# EasyEDA Pro project v1_for_cam.eprj

# Schematic Schematic1
Board Name: Board1; Create Date: 2025-01-07; Page Name: P1; Project Name: v1_for_cam; Schematic Name: Schematic1; Update Date: 2025-01-17; Company: EasyEDA.com; Page Size: A4; Version: V1.0
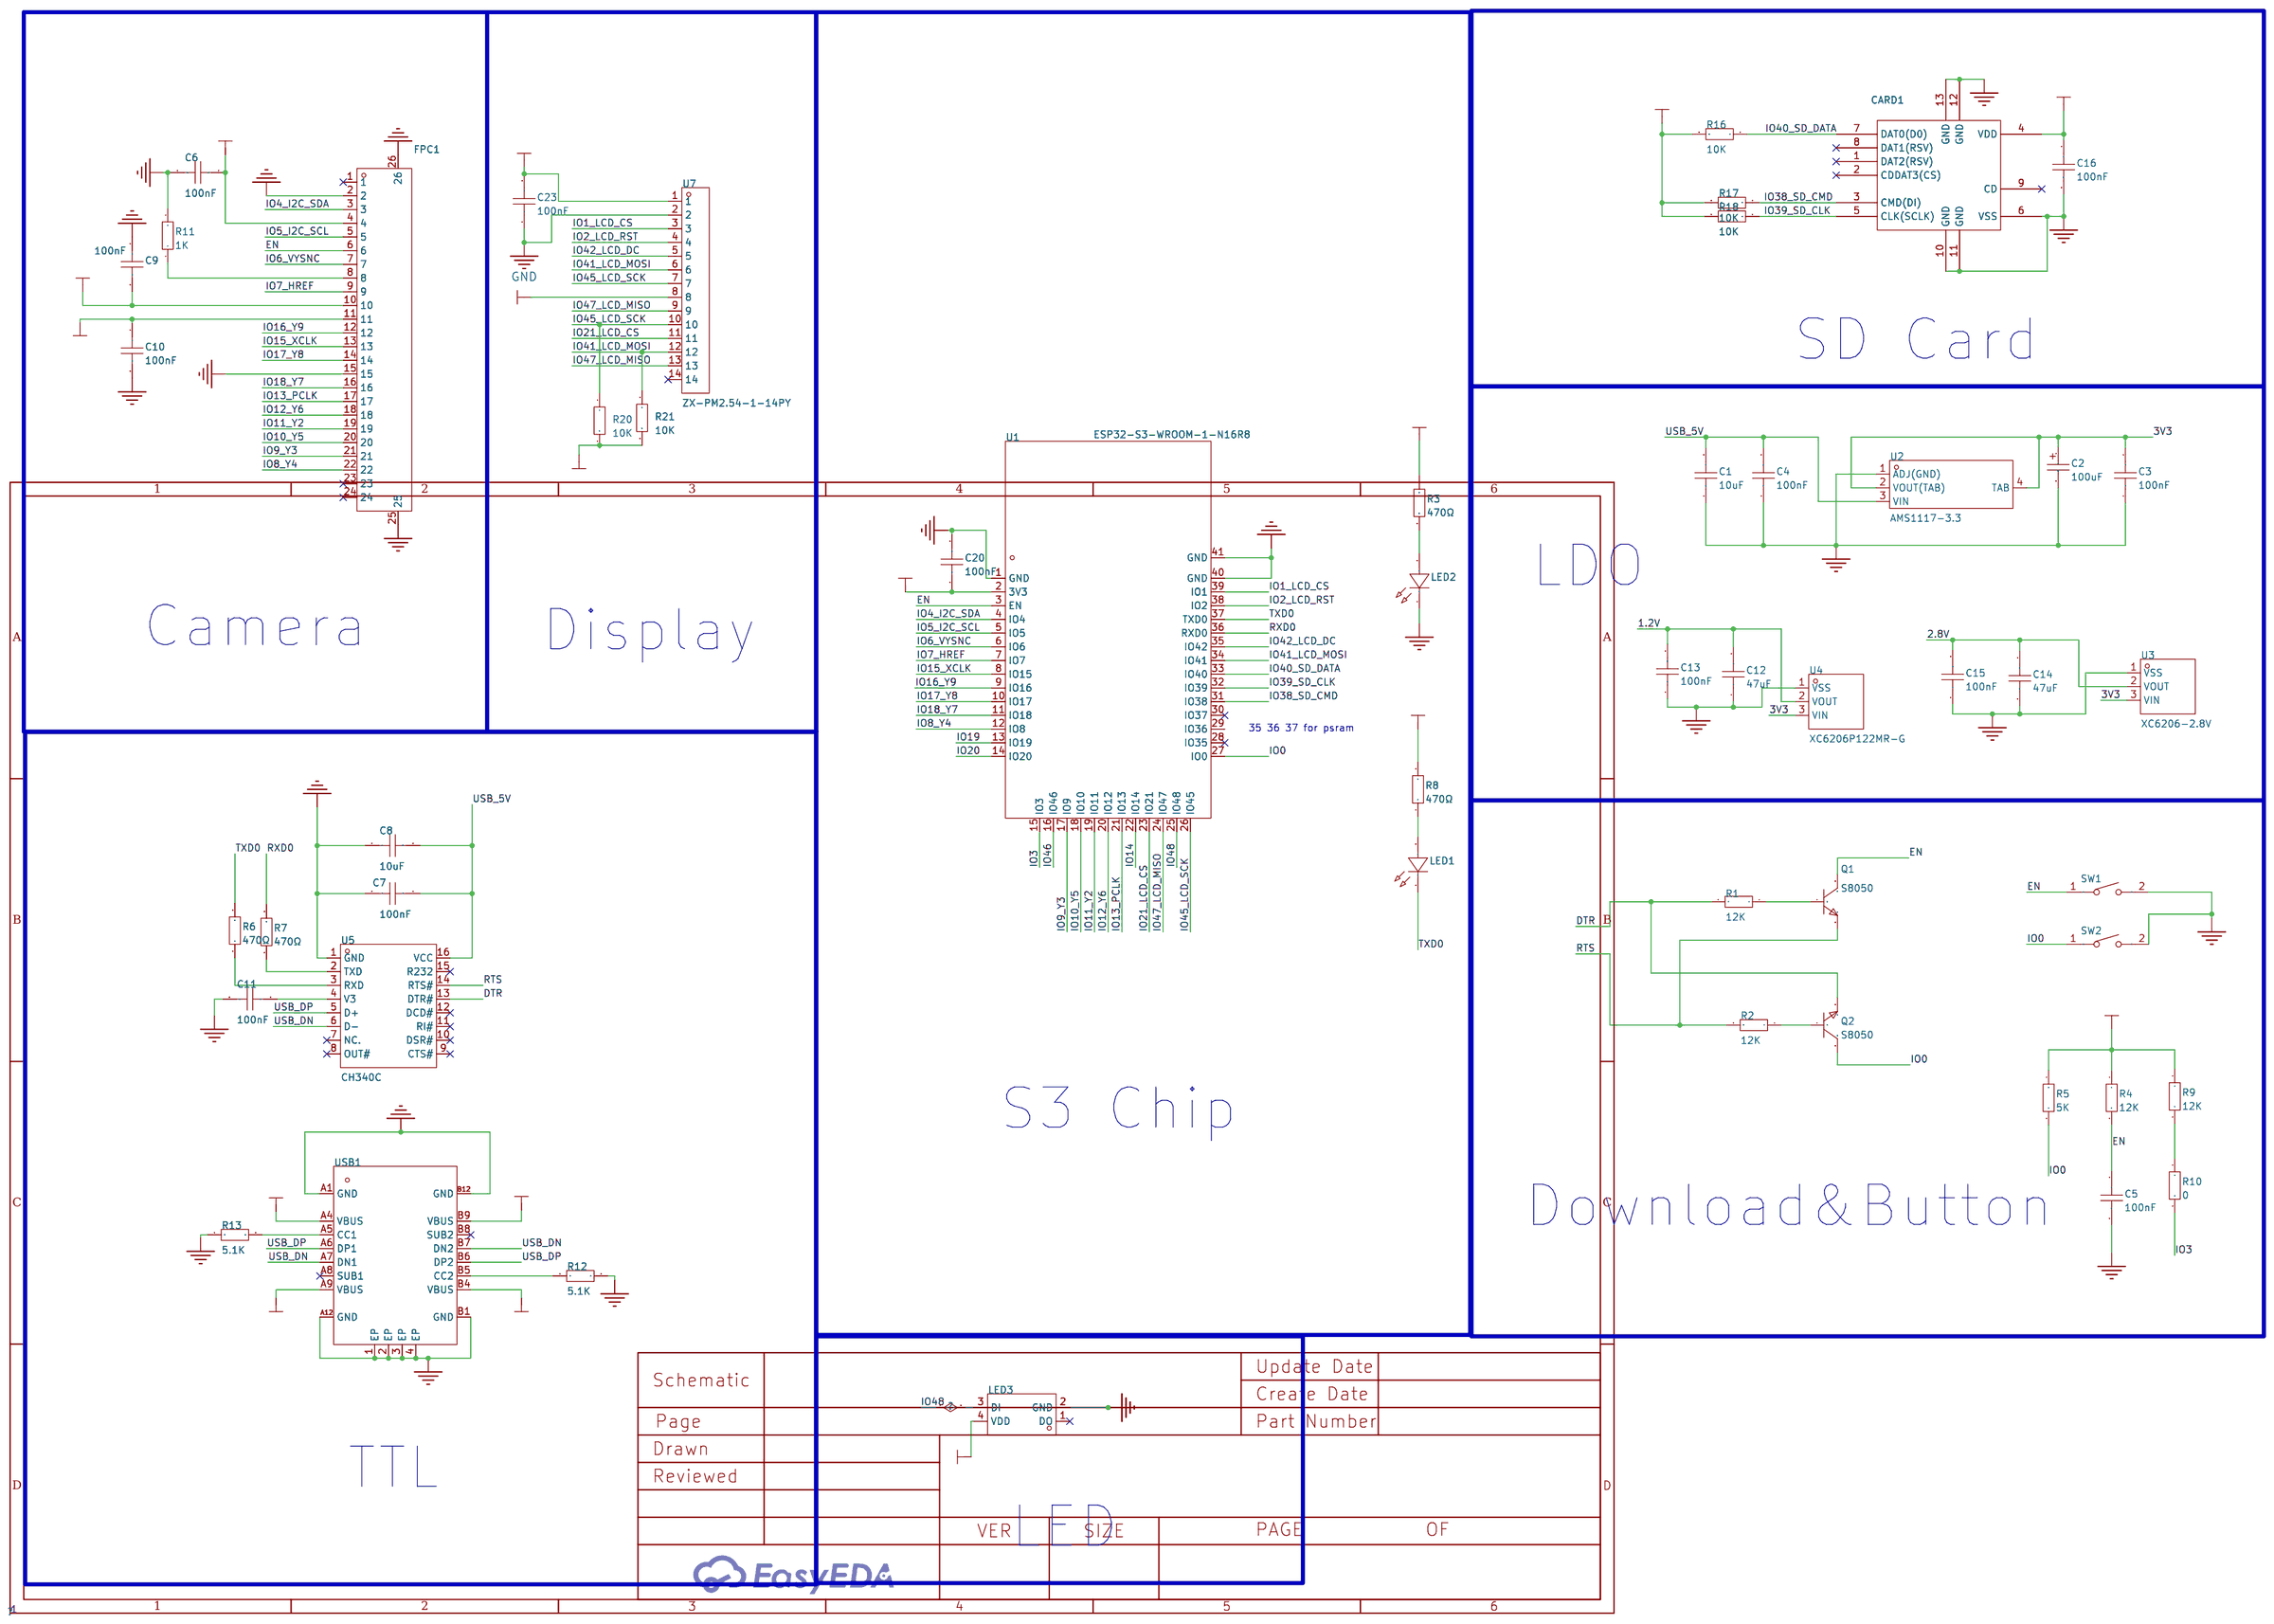
[diagram p0: schematic sheet]

## Parts
C1  10uF  [C0603]
C2  100uF  [CASE-B_3528]
C3  100nF  [C0402]
C4  100nF  [C0402]
C5  100nF  [C0402]
C6  100nF  [C0402]
C7  100nF  [C0402]
C8  10uF  [C0603]
C9  100nF  [C0402]
C10  100nF  [C0402]
C11  100nF  [C0402]
C12  47uF  [C0603]
C13  100nF  [C0402]
C14  47uF  [C0603]
C15  100nF  [C0402]
C16  100nF  [C0402]
C20  100nF  [C0402]
C23  100nF  [C0402]
CARD1  TF-01A  [TF-SMD_TF-01A]
FPC1  0.5K-DX-24PWBG  [FPC-SMD_HDGC_0.5K-DX-24PWBG]
LED1  XL-1608SURC-06  [LED0603-RD_RED]
LED2  XL-1608SURC-06  [LED0603-RD_RED]
LED3  XL-2020RGBC-WS2812B  [LED-SMD_4P-L2.0-W2.0-BR-1]
Q1  S8050  [SOT-23-3_L2.9-W1.3-P1.90-LS2.3-BR]
Q2  S8050  [SOT-23-3_L2.9-W1.3-P1.90-LS2.3-BR]
R1  12K  [R0402]
R2  12K  [R0402]
R3  470Ω  [R0402]
R4  12K  [R0402]
R5  5K  [R0402]
R6  470Ω  [R0402]
R7  470Ω  [R0402]
R8  470Ω  [R0402]
R9  12K  [R0402]
R10  0  [R0402]
R11  1K  [R0402]
R12  5.1K  [R0402]
R13  5.1K  [R0402]
R16  10K  [R0402]
R17  10K  [R0402]
R18  10K  [R0402]
R20  10K  [R0402]
R21  10K  [R0402]
SW1  TS-1088-AR02016  [SW-SMD_L3.9-W3.0-P4.45]
SW2  TS-1088-AR02016  [SW-SMD_L3.9-W3.0-P4.45]
U1  ESP32-S3-WROOM-1-N16R8  [WIRELM-SMD_ESP32-S3-WROOM-1]
U2  AMS1117-3.3  [SOT-223-4_L6.5-W3.5-P2.30-LS7.0-BR]
U3  XC6206-2.8V  [SOT-23-3_L2.9-W1.6-P1.90-LS2.8-BR]
U4  XC6206P122MR-G  [SOT-23-3_L2.9-W1.6-P1.90-LS2.8-BR]
U5  CH340C  [SOP-16_L10.0-W3.9-P1.27-LS6.0-BL]
U7  ZX-PM2.54-1-14PY  [HDR-TH_14P-P2.54-V-F]
USB1  KH-TYPE-C-16P  [USB-C-SMD_KH-TYPE-C-16P]

## Library data of the parts
C1 C8 = CGA0603X5R106K100JT: 容值:10uF;精度:±10%;额定电压:10V;材质(温度系数):X5R;; LCSC Part Name: 10uF ±10% 10V; Supplier Part: C6119842; Manufacturer: HRE(芯声); Supplier Footprint: 0603; JLCPCB Part Class: 扩展库; Supplier: LCSC; Tolerance: ±10%; Voltage Rated: 10V; Temperature Coefficient: X5R
C2 = TAJB107K006RNJ: LCSC Part Name: 100uF ±10% 6.3V; Supplier Part: C16133; Manufacturer: Kyocera AVX; Supplier Footprint: CASE-B-3528-21(mm); Datasheet: https://atta.szlcsc.com/upload/public/pdf/source/20160107/1457707750344.pdf; Supplier: LCSC; Tolerance: ±10%; Rated Voltage: 6.3V; Equivalent Series Resistance(ESR): 1.7Ω@100kHz; Operating Temperature: -55℃~+125℃
C3-C7 C9-C11 C13 C15 C16 C20 C23 = CL05B104KO5NNNC: 容值:100nF;精度:±10%;额定电压:16V;材质(温度系数):X7R;; LCSC Part Name: 100nF ±10% 16V; Supplier Part: C1525; Manufacturer: SAMSUNG(三星); Supplier Footprint: 0402; Datasheet: https://atta.szlcsc.com/upload/public/pdf/source/20160218/1457707763339.pdf; Supplier: LCSC; Tolerance: ±10%; Voltage Rated: 16V; Temperature Coefficient: X7R
C12 C14 = CL10A476MQ8QRNC: 容值:47uF;精度:±20%;额定电压:6.3V;材质(温度系数):X5R;; LCSC Part Name: 47uF ±20% 6.3V; Supplier Part: C730416; Manufacturer: SAMSUNG(三星); Supplier Footprint: 0603; JLCPCB Part Class: 扩展库; Datasheet: https://atta.szlcsc.com/upload/public/pdf/source/20160218/1457707763339.pdf; Supplier: LCSC; Tolerance: ±20%; Voltage Rated: 6.3V; Temperature Coefficient: X5R
CARD1 = TF-01A_C91145: 卡连接方式:自弹式;卡类型:MicroSD卡(TF卡);连接器类型:卡座;本体最大高度:1.85mm;工作温度范围:-;; LCSC Part Name: 自弹式 MicroSD卡(TF卡) 卡座; Supplier Part: C91145; Manufacturer: 韩国韩荣; Supplier Footprint: SMD; JLCPCB Part Class: 扩展库; Datasheet: https://atta.szlcsc.com/upload/public/pdf/source/20190322/C91145_63CBD6FB4639A3A3EC6A9721F18AE0FB.pdf; Supplier: LCSC; Card Connection Mode: 自弹式; Card Type: MicroSD卡(TF卡); Connector Type: 卡座; Supplementary Features: 带定位柱; Maximum Body Height: 1.85mm
FPC1 = 0.5K-DX-24PWBG: 锁定特性:翻盖式;触点类型:下接;触点数量:24P;间距:0.5mm;安装类型:卧贴;工作温度范围:-20℃~+85℃;; LCSC Part Name: 间距:0.5mm P数:24P 翻盖式 下接; Supplier Part: C2911895; Manufacturer: HDGC(华德共创); Supplier Footprint: SMD,P=0.5mm,卧贴; JLCPCB Part Class: 扩展库; Datasheet: https://atta.szlcsc.com/upload/public/pdf/source/20211029/EDC59C5BA257836333CAE013AFC084A6.pdf; Supplier: LCSC; Locking Feature: 翻盖式; Contact Type: 下接; Number of Contacts: 24P; Pitch: 0.5mm; Mounting Type: 卧贴; FFC, FCB Thickness: 0.3mm; Height Above Board: 2mm; Operating Temperature Range: -20℃~+85℃
LED1 LED2 = XL-1608SURC-06: 发光颜色:红色;功率:55mW;正向电流:25mA;主波长:617nm~621nm;透镜颜色:无色透明透镜;色温:-;发光角度:120°;载带方式:正贴;工作温度:-30℃~+85℃;; Supplier Part: C965799; Manufacturer: XINGLIGHT(成兴光); Supplier Footprint: 0603; JLCPCB Part Class: 扩展库; Datasheet: https://atta.szlcsc.com/upload/public/pdf/source/20221102/D860AFDD1CDB02C5A8064103A32707E2.pdf; Supplier: LCSC; Emitted Color: 红色; Power Dissipation: 55mW; Forward Current: 25mA; Dominant Wavelength: 617nm~621nm; Peak Wavelength: 623nm; Lens Color: 无色透明透镜; Viewing Angle: 120°; Mounting Sytle: 正贴; Operating Temperature: -30℃~+85℃
LED3 = XL-2020RGBC-WS2812B: 2020 ws2812B 内置驱动IC（红：IV=50-150mcd，绿：IV=200-400mcd，蓝：IV=50-150mcd，(Typ)@IF=20mA); LCSC Part Name: 幻彩透明; Supplier Part: C5349955; Manufacturer: XINGLIGHT(成兴光); Supplier Footprint: 2020; JLCPCB Part Class: 扩展库; Datasheet: https://atta.szlcsc.com/upload/public/pdf/source/20230111/97A2D5930F183799801175706AF118AF.pdf; Supplier: LCSC; Wavelength: 620nm~625nm；470nm~475nm；525nm~530nm; Luminous Intensity: 150mcd；150mcd；400mcd; Lens Color: 半透明雾状透镜; Installation method: 正贴; Operating Temperature: -20℃~+85℃
Q1 Q2 = S8050_C20069125: 晶体管类型:NPN;集电极电流(Ic):500mA;集射极击穿电压(Vceo):25V;功率(Pd):300mW;直流电流增益(hFE@Ic,Vce):120@50mA,1.0V;; LCSC Part Name: hFE:200-350，丝印:J3Y; Supplier Part: C20069125; Manufacturer: 宏迦橙; Supplier Footprint: SOT-23; JLCPCB Part Class: 扩展库; Datasheet: https://atta.szlcsc.com/upload/public/pdf/source/20240403/2D78449C96B6E27F13BF8BDF79E27159.pdf; Supplier: LCSC; Transistor Type: NPN; Collector Current (Ic): 500mA; Collector-Emitter Breakdown Voltage (Vceo): 25V; Power Dissipation (Pd): 300mW; DC Current Gain (hFE@Ic,Vce): 120@50mA,1.0V; Transition Frequency (fT): 100MHz; Collector Cut-Off Current (Icbo): 100nA; Collector-Emitter Saturation Voltage (VCE(sat)@Ic,Ib): 600mV@500mA,50mA; Operating Temperature: -55℃~+150℃
R1-R13 R16-R18 R20 R21 = 0402WGF4700TCE: 电阻类型:厚膜电阻;阻值:470Ω;精度:±1%;功率:62.5mW;最大工作电压:50V;温度系数:±100ppm/℃;; LCSC Part Name: 470Ω ±1% 62.5mW 厚膜电阻; Supplier Part: C25117; Manufacturer: UNI-ROYAL(厚声); Supplier Footprint: 0402; JLCPCB Part Class: 基础库; Datasheet: https://atta.szlcsc.com/upload/public/pdf/source/20200306/C422600_1E6D84923E4A46A82E41ADD87F860B5C.pdf; Supplier: LCSC; Type: 厚膜电阻; Tolerance: ±1%; Power(Watts): 62.5mW; Overload Voltage (Max): 50V; Temperature Coefficient: ±100ppm/℃; Operating Temperature Range: -55℃~+155℃
SW1 SW2 = TS-1088-AR02016: 电路结构:单刀单掷;按钮形状:圆形按钮;作用力:160gf;安装方式:立贴;开关长度:4mm;开关宽度:3mm;开关高度:2mm;带支架:不带;触点电流:50mA;额定电压(DC):12V;绝缘电阻:100MΩ;机械寿命:10万次;; LCSC Part Name: 4*3*2mm 立贴 轻触开关; Supplier Part: C720477; Manufacturer: XUNPU(讯普); Supplier Footprint: SMD; JLCPCB Part Class: 扩展库; Datasheet: https://atta.szlcsc.com/upload/public/pdf/source/20200810/C720475_60D09DD6C54279ADDB2DC25100F1CC11.pdf; Supplier: LCSC; Circuit: 单刀单掷; Actuator Style: 圆形按钮; Operating Force: 160gf; Mounting Style: 立贴; Switch Length: 4mm; Switch Width: 3mm; Switch Height: 2mm; Strike Gundam: 不带; Contact Current: 50mA; Voltage Rating (DC): 12V; Insulation Resistance: 100MΩ; Actuator/Cap Color: 黑色; Pin Style: SMD接片; Mechanical Life: 10万次; Operating Temperature: -30℃~+80℃
U1 = ESP32-S3-WROOM-1-N16R8: LCSC Part Name: 通用型Wi-Fi+低功耗蓝牙MCU模组; Supplier Part: C2913202; Manufacturer: ESPRESSIF(乐鑫); Supplier Footprint: SMD,18x25.5mm; JLCPCB Part Class: 扩展库; Datasheet: https://atta.szlcsc.com/upload/public/pdf/source/20220705/4E799F39581577F766659887F738A439.pdf; Supplier: LCSC
U2 = AMS1117-3.3_C347222: 输出类型:固定;工作电压:12V;输出电压:3.3V;输出电流:1A;电源纹波抑制比(PSRR):60dB@(120Hz);输出极性:正极;; LCSC Part Name: 输出:3.3V 电流:1A 耐压:12V; Supplier Part: C347222; Manufacturer: UMW(友台半导体); Supplier Footprint: SOT-223; JLCPCB Part Class: 扩展库; Datasheet: https://atta.szlcsc.com/upload/public/pdf/source/20241218/BAF0263FA2E44BCD8AF41AA4FA04EFAA.pdf; Supplier: LCSC; Output Type: 固定; Maximum Input Voltage: 12V; Output Voltage: 3.3V; Output Current: 1A; Power Supply Rejection Ratio (PSRR): 60dB@(120Hz); Dropout Voltage: 1.3V@(1A); Feature: 过流保护(OCP); Output Polarity: 正极; Number of Outputs: 1
U3 = XC6206-2.8V: 输出类型:固定;最大输入电压:6V;输出电压:2.8V;最大输出电流:250mA;输出极性:正极;; LCSC Part Name: 输入6V 输出2.8V 250mA; Supplier Part: C2892669; Manufacturer: YONGYUTAI(永裕泰); Supplier Footprint: SOT-23-3L; JLCPCB Part Class: 扩展库; Datasheet: https://atta.szlcsc.com/upload/public/pdf/source/20210901/DE3C77F0CE73FFE8F7C655BE9B94CB06.pdf; Supplier: LCSC; Output Type: 固定; Maximum Input Voltage: 6V; Output Voltage: 2.8V; MAX Output Current: 250mA; Operating Temperature: -40℃~+85℃@(Tj); Output Polarity: 正极; Number of Outputs: 1
U4 = XC6206P122MR-G: 输出类型:固定;最大输入电压:7V;输出电压:1.2V;最大输出电流:60mA;电源纹波抑制比(PSRR):-;输出极性:正极;; LCSC Part Name: 输入7V 输出1.2V~1.2V 60mA; Supplier Part: C424699; Manufacturer: TOREX(特瑞仕); Supplier Footprint: SOT-23; JLCPCB Part Class: 扩展库; Datasheet: https://atta.szlcsc.com/upload/public/pdf/source/20200117/C484266_EE638359EA530088949E891FD0EEEA32.pdf; Supplier: LCSC; Output Type: 固定; Maximum Input Voltage: 7V; Output Voltage: 1.2V; MAX Output Current: 60mA; Dropout Voltage: 960mV@(60mA); standby current: 3uA; Operating Temperature: -40℃~+85℃@(Ta); Output Polarity: 正极; Number of Outputs: 1
U5 = CH340C: 应用功能:收发器;接口协议:USB 2.0;数据速率:2Mbps;; LCSC Part Name: CH340C USB转串口芯片 CH340; Supplier Part: C84681; Manufacturer: WCH(南京沁恒); Supplier Footprint: SOP-16; Datasheet: https://atta.szlcsc.com/upload/public/pdf/source/20240619/63986D8440D4E5267A77ACD891CC4DE3.pdf; Supplier: LCSC; Applications Function: 收发器; Protocol: USB 2.0; Supply Voltage: 3.3V；5V; Data Rate: 2Mbps
U7 = ZX-PM2.54-1-14PY: LCSC Part Name: 1x14P 间距:2.54mm 直插; Supplier Part: C7499332; Manufacturer: Megastar(兆星); Supplier Footprint: 插件,P=2.54mm; Datasheet: https://atta.szlcsc.com/upload/public/pdf/source/20231122/596EEFA73C1FA9E4FFE7F8A6F76E9BC7.pdf; Supplier: LCSC; Holes Structure: 1x14P; Pitch: 2.54mm; Circular Hole / Square Hole: Square Hole; Mounting Type: Direct Insert; Number of Rows: Single Row; Number of Holes: 14P; Voltage Rating (Max): 1kV; Holes Direction: Top; Insulation Height: 8.5mm; Contact Plating: Gold; Operating Temperature Range: -40℃~+105℃; Soldering Temperature(Max): 260℃@5S
USB1 = KH-TYPE-C-16P: 连接器类型:Type-C;标准:-;公母:母;端口数量:1;触点数量:16P;安装方式:卧贴;额定电流 - 电源:3A;工作温度范围:-40℃~+85℃;; LCSC Part Name: Type-C 母 卧贴; Supplier Part: C709357; Manufacturer: kinghelm(金航标); Supplier Footprint: SMD; Datasheet: https://atta.szlcsc.com/upload/public/pdf/source/20200911/C709357_AA8DCEB38BB20E3035A7ED7AE7667837.pdf; Supplier: LCSC; Connector Type: Type-C; Gender: 母; Number of Ports: 1; Number of Contacts: 16P; Mounting Style: 卧贴; Current Rating - Power (Max): 3A; Operating Temperature Range: -40℃~+85℃

## Nets
1.2V: C9.2 C12.2 C13.2 FPC1.10 U4.2(VOUT)
2.8V: C6.1 C10.1 C14.1 C15.2 FPC1.4 FPC1.11 U3.2(VOUT)
3V3: C2.1 C3.2 C16.1 C20.1 C23.2 CARD1.4(VDD) R3.1 R4.1 R5.1 R8.2 R9.1 R16.2 R17.2 R18.2 R20.2 R21.2 U1.2(3V3) U2.2(VOUT(TAB)) U2.4(TAB) U3.3(VIN) U4.3(VIN) U7.1 U7.8
GND: C1.1 C2.2 C3.1 C4.1 C5.2 C6.2 C7.2 C8.2 C9.1 C10.2 C11.2 C12.1 C13.1 C14.2 C15.1 C16.2 C20.2 C23.1 CARD1.6(VSS) CARD1.10(GND) CARD1.11(GND) CARD1.12(GND) CARD1.13(GND) FPC1.2 FPC1.15 FPC1.25 FPC1.26 LED2.1(K) LED3.2(GND) R11.2 R12.2 R13.1 SW1.2 SW2.2 U1.1(GND) U1.40(GND) U1.41(GND) U2.1(ADJ(GND)) U3.1(VSS) U4.1(VSS) U5.1(GND) U7.2 USB1.1(EP) USB1.2(EP) USB1.3(EP) USB1.4(EP) USB1.A1(GND) USB1.A12(GND) USB1.B1(GND) USB1.B12(GND)
DTR: Q2.2(E) R1.2 U5.13(DTR#)
EN: C5.1 FPC1.6 Q1.3(C) R4.2 SW1.1 U1.3(EN)
IO0: Q2.3(C) R5.2 SW2.1 U1.27(IO0)
IO1_LCD_CS: U1.39(IO1) U7.3
IO2_LCD_RST: U1.38(IO2) U7.4
IO3: R10.2 U1.15(IO3)
IO4_I2C_SDA: FPC1.3 U1.4(IO4)
IO5_I2C_SCL: FPC1.5 U1.5(IO5)
IO6_VYSNC: FPC1.7 U1.6(IO6)
IO7_HREF: FPC1.9 U1.7(IO7)
IO8_Y4: FPC1.22 U1.12(IO8)
IO9_Y3: FPC1.21 U1.17(IO9)
IO10_Y5: FPC1.20 U1.18(IO10)
IO11_Y2: FPC1.19 U1.19(IO11)
IO12_Y6: FPC1.18 U1.20(IO12)
IO13_PCLK: FPC1.17 U1.21(IO13)
IO14: U1.22(IO14)
IO15_XCLK: FPC1.13 U1.8(IO15)
IO16_Y9: FPC1.12 U1.9(IO16)
IO17_Y8: FPC1.14 U1.10(IO17)
IO18_Y7: FPC1.16 U1.11(IO18)
IO19: U1.13(IO19)
IO20: U1.14(IO20)
IO21_LCD_CS: U1.23(IO21) U7.11
IO38_SD_CMD: CARD1.3(CMD(DI)) R17.1 U1.31(IO38)
IO39_SD_CLK: CARD1.5(CLK(SCLK)) R18.1 U1.32(IO39)
IO40_SD_DATA: CARD1.7(DAT0(D0)) R16.1 U1.33(IO40)
IO41_LCD_MOSI: R21.1 U1.34(IO41) U7.6 U7.12
IO42_LCD_DC: U1.35(IO42) U7.5
IO45_LCD_SCK: R20.1 U1.26(IO45) U7.7 U7.10
IO46: U1.16(IO46)
IO47_LCD_MISO: U1.24(IO47) U7.9 U7.13
IO48: LED3.3(DI) U1.25(IO48)
RTS: Q1.2(E) R2.2 U5.14(RTS#)
RXD0: R7.2 U1.36(RXD0)
TXD0: LED1.1(K) R6.2 U1.37(TXD0)
USB_5V: C1.2 C4.2 C7.1 C8.1 LED3.4(VDD) U2.3(VIN) U5.16(VCC) USB1.A4(VBUS) USB1.A9(VBUS) USB1.B4(VBUS) USB1.B9(VBUS)
USB_DN: U5.6(D-) USB1.A7(DN1) USB1.B7(DN2)
USB_DP: U5.5(D+) USB1.A6(DP1) USB1.B6(DP2)
$1N3939: R7.1 U5.2(TXD)
$1N3940: R6.1 U5.3(RXD)
$1N3941: C11.1 U5.4(V3)
$1N3953: Q1.1(B) R1.1
$1N3956: Q2.1(B) R2.1
$1N3967: R9.2 R10.1
$1N4024: FPC1.8 R11.1
Net-(LED1-2): LED1.2(A) R8.1
Net-(LED2-2): LED2.2(A) R3.2
Net-(R12-1): R12.1 USB1.B5(CC2)
Net-(R13-2): R13.2 USB1.A5(CC1)

Not connected (* = marked no-connect by the designer): CARD1 1(DAT2(RSV))* 2(CDDAT3(CS))* 8(DAT1(RSV))* 9(CD)*; FPC1 1* 23* 24*; LED3 1(DO)*; U1 28(IO35)* 29(IO36) 30(IO37)*; U5 7(NC.)* 8(OUT#)* 9(CTS#)* 10(DSR#)* 11(RI#)* 12(DCD#)* 15(R232)*; U7 14*; USB1 A8(SUB1)* B8(SUB2)*

## Notes on the sheet
- SD Card
- LDO
- Camera
- Display
- 35 36 37 for psram
- S3 Chip
- Download&Button
- TTL
- LED

# Board PCB1
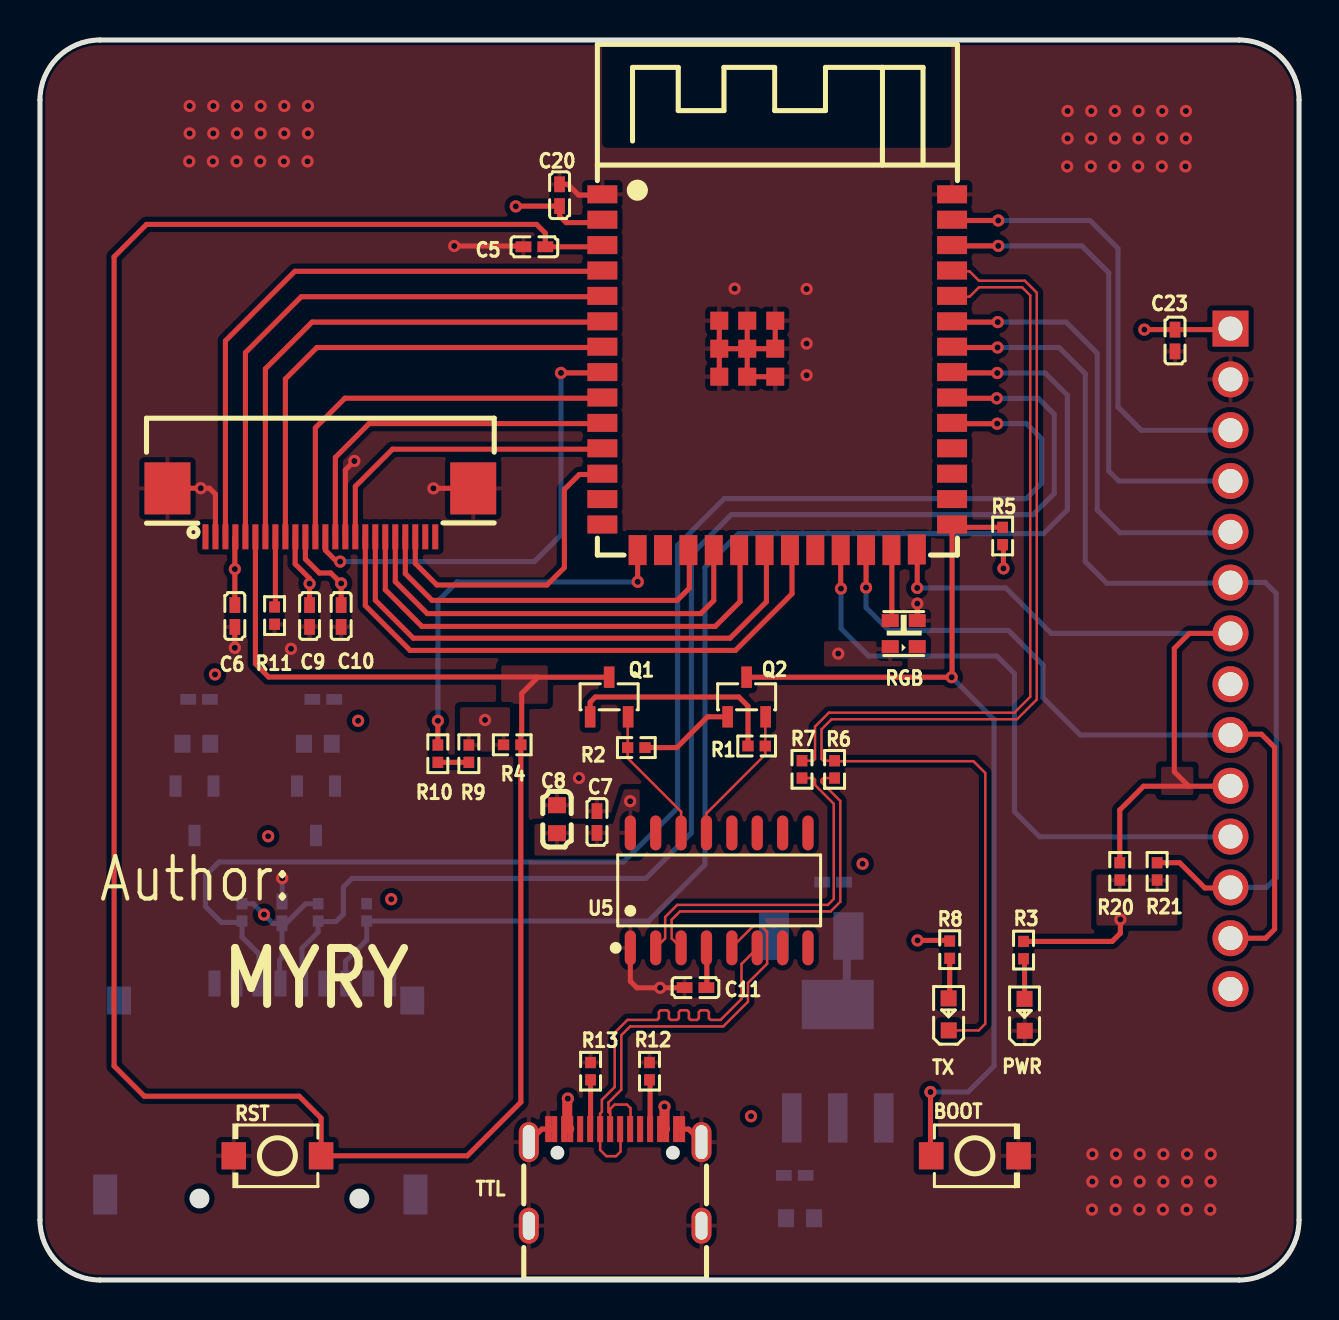
[diagram p1: board, top side]
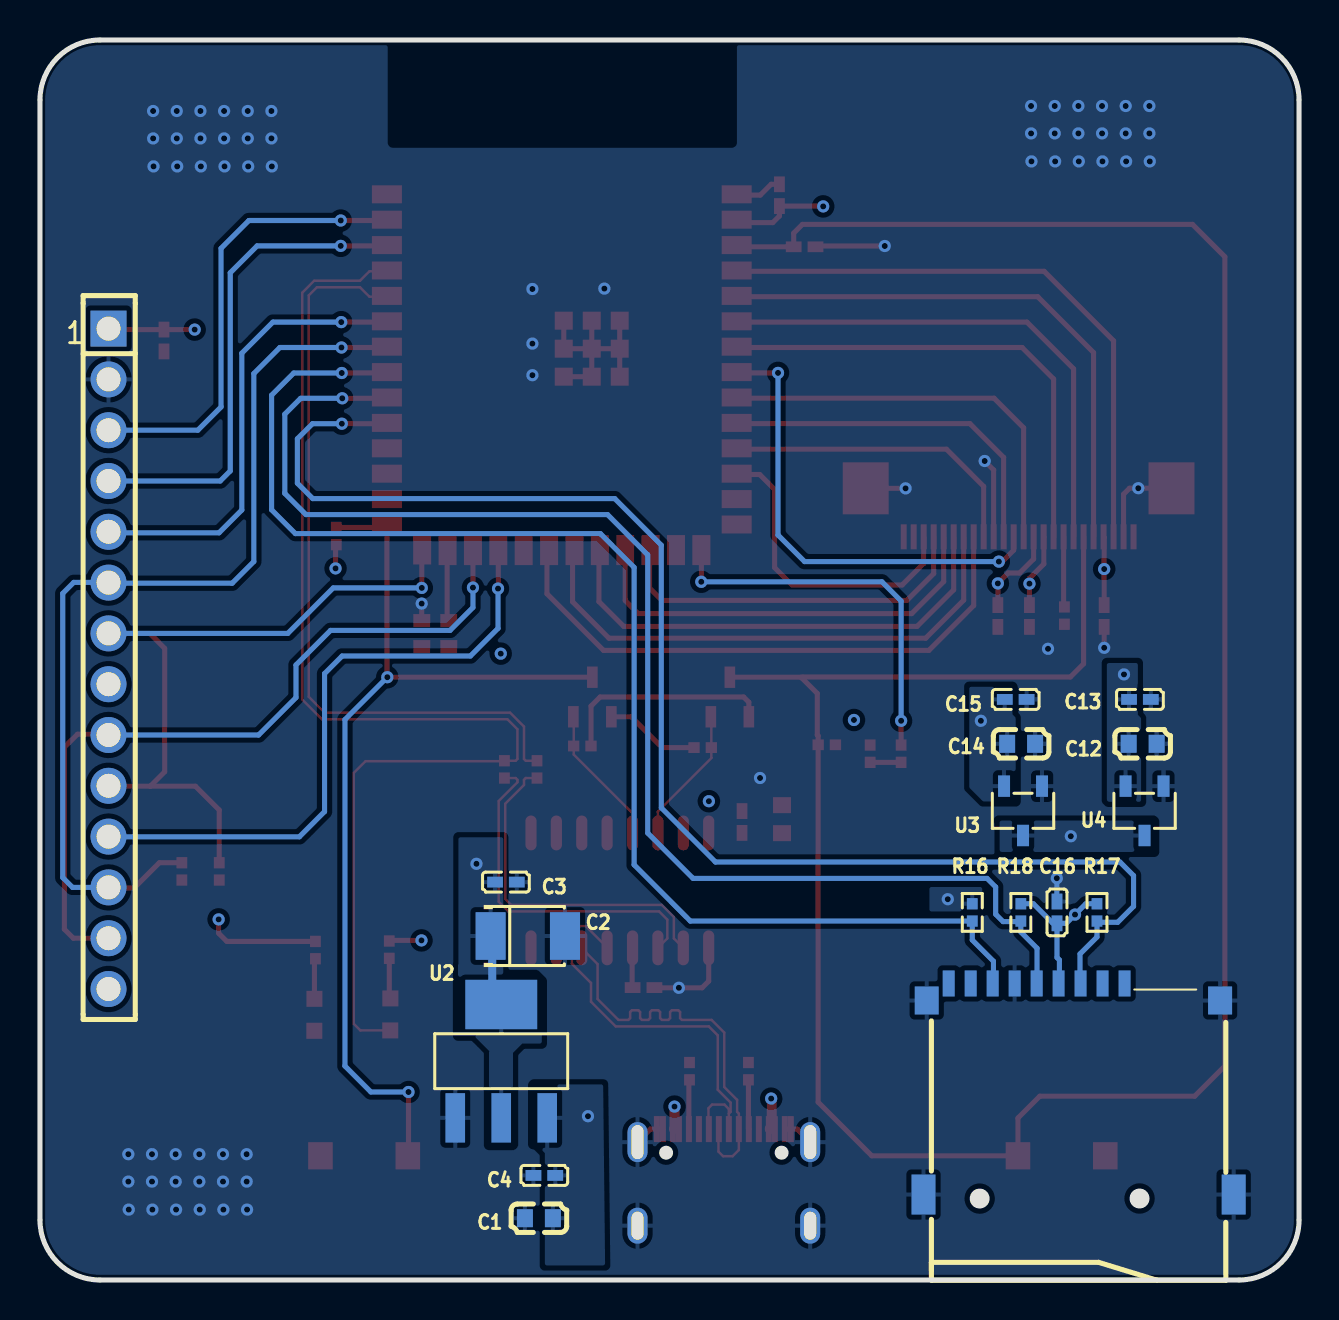
[diagram p2: board, bottom side, seen from below]

Outline 63 x 62 mm; copper layers: Top Layer, GND, PWR, Bottom Layer. Coordinates in mm from the lower left corner of the outline.
Outline path: 0,59 0,3 arc(0.88,0.88) 3,0 60,0 arc(62.12,0.88) 63,3 63,59 arc(62.12,61.12) 60,62 3,62 arc(0.88,61.12) 0,59
Stack: Top Layer 0.035mm Outer layer copper thickness 1oz / Dielectric1 0.0994mm 7628 RC49% 8.6mil / GND 0.0152mm Inner layer copper thickness / Dielectric2 1.265mm 1.1mm H/HOZ Copper / PWR 0.0152mm Inner layer copper thickness / Dielectric3 0.0994mm 7628 RC49% 8.6mil / Bottom Layer 0.035mm Outer layer copper thickness 1oz

## Design rules (mm)
net TXD0: DP3
net RTS: DP4
net DTR: DP4
net $1N3940: DP2
net RXD0: DP3
net $1N3939: DP2
net USB_DP: DP1
net USB_DN: DP1
template: Custom Config
spacing copperThickness1oz (default): track to track 0.102, other pairs 0.152 to 0.3
spacing copperThickness2oz: track to track 0.203, other pairs 0.152 to 0.3
track width copperThickness1oz (default): min 0.127, default 0.254, max 2.54
track width copperThickness2oz: min 0.203, default 0.254, max 2.54
differential pair differentialPair (default): width min 0.124, default 0.124, max 0.124; gap min 0.203, default 0.203
via viaSize (default): diameter min 0.5, default 0.61, max 10; hole min 0.3, default 0.305, max 6.3

## Placement (name value [footprint] x y rotation side)
BOOT  TS-1088-AR02016  [SW-SMD_L3.9-W3.0-P4.45]  46.78 6.21 0 top
C1  10uF  [C0603]  38.03 3.09 180 bottom
C2  100uF  [CASE-B_3528]  38.59 17.2 180 bottom
C3  100nF  [C0402]  39.68 19.9 0 bottom
C4  100nF  [C0402]  37.76 5.23 180 bottom
C5  100nF  [C0402]  24.74 51.66 180 top
C6  100nF  [C0402]  9.75 33.2 270 top
C7  100nF  [C0402]  27.87 22.9 90 top
C8  10uF  [C0603]  25.87 23.04 90 top
C9  100nF  [C0402]  13.49 33.2 90 top
C10  100nF  [C0402]  15.07 33.2 270 top
C11  100nF  [C0402]  32.8 14.62 180 top
C12  47uF  [C0603]  7.83 26.81 0 bottom
C13  100nF  [C0402]  7.96 29.03 0 bottom
C14  47uF  [C0603]  13.91 26.81 180 bottom
C15  100nF  [C0402]  14.18 29.03 0 bottom
C16  100nF  [C0402]  12.11 18.38 90 bottom
C20  100nF  [C0402]  26 54.24 90 top
C23  100nF  [C0402]  56.8 46.98 90 top
CARD1  TF-01A  [TF-SMD_TF-01A]  11.03 9.55 180 bottom
FPC1  0.5K-DX-24PWBG  [FPC-SMD_HDGC_0.5K-DX-24PWBG]  14.03 38.37 180 top
PWR  XL-1608SURC-06  [LED0603-RD_RED]  49.27 13.26 90 top
Q1  S8050  [SOT-23-3_L2.9-W1.3-P1.90-LS2.3-BR]  28.48 29.15 270 top
Q2  S8050  [SOT-23-3_L2.9-W1.3-P1.90-LS2.3-BR]  35.36 29.15 270 top
R1  12K  [R0402]  35.86 26.7 0 top
R2  12K  [R0402]  29.84 26.62 180 top
R3  470Ω  [R0402]  49.22 16.5 270 top
R4  12K  [R0402]  23.63 26.76 0 top
R5  5K  [R0402]  48.17 37.2 90 top
R6  470Ω  [R0402]  39.76 25.53 90 top
R7  470Ω  [R0402]  38.13 25.53 90 top
R8  470Ω  [R0402]  45.52 16.52 90 top
R9  12K  [R0402]  21.46 26.31 270 top
R10  0  [R0402]  19.91 26.31 90 top
R11  1K  [R0402]  11.74 33.22 270 top
R12  5.1K  [R0402]  30.5 10.44 90 top
R13  5.1K  [R0402]  27.55 10.44 270 top
R16  10K  [R0402]  16.35 18.38 90 bottom
R17  10K  [R0402]  10.11 18.38 90 bottom
R18  10K  [R0402]  13.92 18.38 90 bottom
R20  10K  [R0402]  54.03 20.43 270 top
R21  10K  [R0402]  55.9 20.43 270 top
RGB  XL-2020RGBC-WS2812B  [LED-SMD_4P-L2.0-W2.0-BR-1]  43.22 32.32 0 top
RST  TS-1088-AR02016  [SW-SMD_L3.9-W3.0-P4.45]  11.88 6.21 180 top
TTL  KH-TYPE-C-16P  [USB-C-SMD_KH-TYPE-C-16P]  28.78 5.13 0 top
TX  XL-1608SURC-06  [LED0603-RD_RED]  45.47 13.28 90 top
U1  ESP32-S3-WROOM-1-N16R8  [WIRELM-SMD_ESP32-S3-WROOM-1]  36.89 45.39 0 top
U2  AMS1117-3.3  [SOT-223-4_L6.5-W3.5-P2.30-LS7.0-BR]  39.92 10.94 270 bottom
U3  XC6206-2.8V  [SOT-23-3_L2.9-W1.6-P1.90-LS2.8-BR]  13.81 23.46 90 bottom
U4  XC6206P122MR-G  [SOT-23-3_L2.9-W1.6-P1.90-LS2.8-BR]  7.73 23.46 90 bottom
U5  CH340C  [SOP-16_L10.0-W3.9-P1.27-LS6.0-BL]  33.98 19.48 0 top
U7  ZX-PM2.54-1-14PY  [HDR-TH_14P-P2.54-V-F]  59.57 31.06 270 bottom

## Footprints (pads in the part's own frame, mm; a bottom-side part is the same pattern mirrored in y, then rotated)
C0402
  rect 0.79x0.54 smd: 1(-0.545,0) 2(0.545,0)
C0603
  rect 0.8x0.9 smd: 1(-0.7,0) 2(0.7,0)
CASE-B_3528
  rect 1.506x2.376 smd: 1(-1.861,0) 2(1.861,0)
FPC-SMD_HDGC_0.5K-DX-24PWBG
  rect 0.3x1.25 smd: 1(5.75,1.212) 2(5.25,1.212) 3(4.75,1.212) 4(4.25,1.212) 5(3.75,1.212) 6(3.25,1.212) 7(2.75,1.212) 8(2.25,1.212) 9(1.75,1.212) 10(1.25,1.212) 11(0.75,1.212) 12(0.25,1.212) 13(-0.25,1.212) 14(-0.75,1.212) 15(-1.25,1.212) 16(-1.75,1.212) 17(-2.25,1.212) 18(-2.75,1.212) 19(-3.25,1.212) 20(-3.75,1.212) 21(-4.25,1.212) 22(-4.75,1.212) 23(-5.25,1.212) 24(-5.75,1.212)
  rect 2.3x2.6 smd: 25(-7.65,-1.212) 26(7.65,-1.212)
HDR-TH_14P-P2.54-V-F
  rect 1.8x1.8 hole 1.2: 1(-16.51,0)
  round 1.8 hole 1.2: 2(-13.97,0) 3(-11.43,0) 4(-8.89,0) 5(-6.35,0) 6(-3.81,0) 7(-1.27,0) 8(1.27,0) 9(3.81,0) 10(6.35,0) 11(8.89,0) 12(11.43,0) 13(13.97,0) 14(16.51,0)
LED0603-RD_RED
  rect 0.8x0.8 smd: 1(-0.799,-0.004) 2(0.799,0.004)
LED-SMD_4P-L2.0-W2.0-BR-1
  rect 0.85x0.65 smd: 1(0.675,-0.65) 2(0.675,0.65) 3(-0.675,0.65) 4(-0.675,-0.65)
R0402
  rect 0.566x0.54 smd: 1(-0.433,0) 2(0.433,0)
SOP-16_L10.0-W3.9-P1.27-LS6.0-BL
  oval 0.56x1.745 smd: 1(-4.445,-2.873) 2(-3.175,-2.873) 3(-1.905,-2.873) 4(-0.635,-2.873) 5(0.635,-2.873) 6(1.905,-2.873) 7(3.175,-2.873) 8(4.445,-2.873) 9(4.445,2.873) 10(3.175,2.873) 11(1.905,2.873) 12(0.635,2.873) 13(-0.635,2.873) 14(-1.905,2.873) 15(-3.175,2.873) 16(-4.445,2.873)
SOT-23-3_L2.9-W1.3-P1.90-LS2.3-BR
  rect 1.07x0.532 smd: 1(0.99,-0.95) 2(0.99,0.95) 3(-0.99,0)
SOT-23-3_L2.9-W1.6-P1.90-LS2.8-BR
  rect 1.07x0.6 smd: 1(1.235,-0.95) 2(1.235,0.95) 3(-1.235,0)
SOT-223-4_L6.5-W3.5-P2.30-LS7.0-BR
  rect 2.47x0.98 smd: 1(2.835,-2.3) 2(2.835,0) 3(2.835,2.3)
  rect 2.47x3.6 smd: 4(-2.835,0)
SW-SMD_L3.9-W3.0-P4.45
  rect 1.23x1.36 smd: 1(-2.185,0) 2(2.185,0)
TF-SMD_TF-01A
  rect 0.6x1.3 smd: 1(2.3,5.276) 2(1.2,5.276) 3(0.101,5.276) 4(-1,5.276) 5(-2.099,5.276) 6(-3.2,5.276) 7(-4.3,5.276) 8(-5.399,5.276) 9(-6.5,5.276)
  rect 1.2x1.4 smd: 10(-7.599,4.426) 13(7.08,4.426)
  rect 1.2x2 smd: 11(-7.76,-5.276) 12(7.76,-5.276)
USB-C-SMD_KH-TYPE-C-16P
  oval 1x2 hole 0.6x1.7: 1(-4.32,1.765) 2(4.32,1.765)
  oval 1x1.8 hole 0.6x1.4: 3(-4.32,-2.415) 4(4.32,-2.415)
  rect 0.3x1.3 smd: A1(-3.35,2.415) A4(-2.55,2.415) A5(-1.25,2.415) A6(-0.25,2.415) A7(0.25,2.415) A8(1.25,2.415) A9(2.55,2.415) A12(3.35,2.415) B1(3.05,2.415) B4(2.25,2.415) B5(1.75,2.415) B6(0.75,2.415) B7(-0.75,2.415) B8(-1.75,2.415) B9(-2.25,2.415) B12(-3.05,2.415)
WIRELM-SMD_ESP32-S3-WROOM-1
  rect 1.5x0.9 smd: 1(-8.75,8.895) 2(-8.75,7.625) 3(-8.75,6.355) 4(-8.75,5.085) 5(-8.75,3.815) 6(-8.75,2.545) 7(-8.75,1.275) 8(-8.75,0.005) 9(-8.75,-1.265) 10(-8.75,-2.535) 11(-8.75,-3.805) 12(-8.75,-5.075) 13(-8.75,-6.345) 14(-8.75,-7.615) 27(8.75,-7.615) 28(8.75,-6.345) 29(8.75,-5.075) 30(8.75,-3.805) 31(8.75,-2.535) 32(8.75,-1.265) 33(8.75,0.005) 34(8.75,1.275) 35(8.75,2.545) 36(8.75,3.815) 37(8.75,5.085) 38(8.75,6.355) 39(8.75,7.625) 40(8.75,8.895)
  rect 0.9x1.5 smd: 15(-6.985,-8.895) 16(-5.715,-8.895) 17(-4.445,-8.895) 18(-3.175,-8.895) 19(-1.905,-8.895) 20(-0.635,-8.895) 21(0.635,-8.895) 22(1.905,-8.895) 23(3.175,-8.895) 24(4.445,-8.895) 25(5.715,-8.895) 26(6.985,-8.865)
  rect 0.9x0.9 smd: 41(-2.9,2.575) 41(-2.9,1.175) 41(-2.9,-0.225) 41(-1.5,2.575) 41(-1.5,1.175) 41(-1.5,-0.225) 41(-0.1,2.575) 41(-0.1,1.175) 41(-0.1,-0.225)

## Nets
1.2V: C9.2 C12.2 C13.2 FPC1.10 U4.2
2.8V: C6.1 C10.1 C14.1 C15.2 FPC1.4 FPC1.11 U3.2
3V3: C2.1 C3.2 C16.1 C20.1 C23.2 CARD1.4 R3.1 R4.1 R5.1 R8.2 R9.1 R16.2 R17.2 R18.2 R20.2 R21.2 U1.2 U2.2 U2.4 U3.3 U4.3 U7.1 U7.8
GND: BOOT.2 C1.1 C2.2 C3.1 C4.1 C5.2 C6.2 C7.2 C8.2 C9.1 C10.2 C11.2 C12.1 C13.1 C14.2 C15.1 C16.2 C20.2 C23.1 CARD1.6 CARD1.10 CARD1.11 CARD1.12 CARD1.13 FPC1.2 FPC1.15 FPC1.25 FPC1.26 PWR.1 R11.2 R12.2 R13.1 RGB.2 RST.2 TTL.1 TTL.2 TTL.3 TTL.4 TTL.A1 TTL.A12 TTL.B1 TTL.B12 U1.1 U1.40 U1.41 U2.1 U3.1 U4.1 U5.1 U7.2
DTR: Q2.2 R1.2 U5.13
EN: C5.1 FPC1.6 Q1.3 R4.2 RST.1 U1.3
IO0: BOOT.1 Q2.3 R5.2 U1.27
IO1_LCD_CS: U1.39 U7.3
IO2_LCD_RST: U1.38 U7.4
IO3: R10.2 U1.15
IO4_I2C_SDA: FPC1.3 U1.4
IO5_I2C_SCL: FPC1.5 U1.5
IO6_VYSNC: FPC1.7 U1.6
IO7_HREF: FPC1.9 U1.7
IO8_Y4: FPC1.22 U1.12
IO9_Y3: FPC1.21 U1.17
IO10_Y5: FPC1.20 U1.18
IO11_Y2: FPC1.19 U1.19
IO12_Y6: FPC1.18 U1.20
IO13_PCLK: FPC1.17 U1.21
IO14: U1.22
IO15_XCLK: FPC1.13 U1.8
IO16_Y9: FPC1.12 U1.9
IO17_Y8: FPC1.14 U1.10
IO18_Y7: FPC1.16 U1.11
IO19: U1.13
IO20: U1.14
IO21_LCD_CS: U1.23 U7.11
IO38_SD_CMD: CARD1.3 R17.1 U1.31
IO39_SD_CLK: CARD1.5 R18.1 U1.32
IO40_SD_DATA: CARD1.7 R16.1 U1.33
IO41_LCD_MOSI: R21.1 U1.34 U7.6 U7.12
IO42_LCD_DC: U1.35 U7.5
IO45_LCD_SCK: R20.1 U1.26 U7.7 U7.10
IO46: U1.16
IO47_LCD_MISO: U1.24 U7.9 U7.13
IO48: RGB.3 U1.25
RTS: Q1.2 R2.2 U5.14
RXD0: R7.2 U1.36
TXD0: R6.2 TX.1 U1.37
USB_5V: C1.2 C4.2 C7.1 C8.1 RGB.4 TTL.A4 TTL.A9 TTL.B4 TTL.B9 U2.3 U5.16
USB_DN: TTL.A7 TTL.B7 U5.6
USB_DP: TTL.A6 TTL.B6 U5.5
$1N3905: U1.29
$1N3928: R8.1 TX.2
$1N3930: PWR.2 R3.2
$1N3939: R7.1 U5.2
$1N3940: R6.1 U5.3
$1N3941: C11.1 U5.4
$1N3953: Q1.1 R1.1
$1N3956: Q2.1 R2.1
$1N3967: R9.2 R10.1
$1N3982: R12.1 TTL.B5
$1N3984: R13.2 TTL.A5
$1N4024: FPC1.8 R11.1

Pads without a net: CARD1 1 2 8 9; FPC1 1 23 24; RGB 1; TTL A8 B8; U1 28 30; U5 7 8 9 10 11 12 15; U7 14

## Via types
v1: diameter 0.61, hole 0.305, Top Layer to Bottom Layer, 104 vias

## Routing (per net, layer and track width the routed paths; a pad name or vN(x,y) marks a point on that pad's centre or on a via; arc(x,y) is an arc through that point)
1.2V: length 12.4
  Top Layer w0.254: 13.49,33.78 13.49,35.08 12.77,35.8 12.77,37.15 FPC1.10
  PWR w0.254: v1(8.76,30.28) 10.19,30.28 10.81,30.9 10.81,34.45 11.18,34.82 v1(13.49,34.82)
2.8V: length 20.6
  Top Layer w0.254: FPC1.11 13.28,36.05 13.98,35.35 14.55,35.35 v1(15.07,34.83) C10.1 ; FPC1.4 9.75,37.13 v1(9.75,35.55) 9.75,33.95
  PWR w0.254: v1(15.92,27.96) 15.92,33.98 v1(15.07,34.83) 14.35,35.55 v1(9.75,35.55)
3V3: length 175.3
  Top Layer w0.254: R3.1 53.65,16.93 54.06,17.34 v1(54.06,18.03) ; R8.2 45.49,16.98 v1(43.91,16.98) ; v1(55.26,47.52) C23.2 59.52,47.52 U7.1 ; R5.1 48.21,36.73 v1(48.21,35.58) ; 28.14,52.98 28.03,52.87 26.33,52.87 26,53.2 C20.1 23.83,53.7 v1(23.81,53.68)
  PWR w0.254: 43.18,20.78 43.93,20.03 43.93,17 v1(43.91,16.98) ; 43.18,20.78 51.31,20.78 ; 43.18,20.78 41.19,20.78 v1(41.16,20.81) 41.16,25.38 42.6,26.82 46.91,26.82 48.21,28.12 v1(48.21,35.58) ; 17.65,22.14 11.47,22.14 v1(11.42,22.19) 11.17,21.94 11.17,18.13 ; 17.65,22.14 17.65,19.11 v1(17.58,19.04) ; 17.65,22.14 21.14,22.14 22.27,23.27 v1(22.27,28) 22.26,28.01 22.26,33.95 23.89,35.58 ; v1(48.21,35.58) 52.92,35.58 53.63,36.29 53.63,45.89 v1(55.26,47.52) ; v1(48.21,35.58) 23.89,35.58 ; v1(23.81,53.68) 23.81,35.66 23.89,35.58 ; 51.31,20.78 51.31,28.71 52.34,29.74 59.52,29.74 U7.8 ; 51.31,20.78 v1(54.06,18.03)
  Bottom Layer w0.254: C16.1 12.31,17.84 13.29,18.81 R18.2 ; C16.1 11.64,17.84 v1(11.21,18.27) 10.67,18.81 R17.2 ; C16.1 12.11,16.12 11.99,16 11.99,14.87 CARD1.4
  Bottom Layer w0.4: 40.37,16.59 40.37,14.23 U2.4
GND: length 38.7
  Top Layer w0.254: 33.99,45.17 U1.41 ; U1.41 U1.41 ; U1.41 U1.41 ; U1.41 U1.41 U1.41 ; 19.68,39.59 v1(19.69,39.58) FPC1.25 ; U5.1 29.54,14.94 29.87,14.61 v1(31.03,14.61) 32.24,14.61 32.25,14.62 ; U1.41 35.39,45.17 36.79,45.17 ; U1.41 U1.41 ; v1(43.9,33.82) 43.9,32.85 43.89,32.84 ; TTL.B1 TTL.A12 32.45,7.55 TTL.2 ; v1(15.73,40.95) 15.28,40.5 FPC1.15 ; v1(20.73,51.7) 24.15,51.7 C5.2 ; 28.14,54.25 26.95,54.25 26.42,54.79 C20.2 ; TTL.B12 TTL.A1 25.11,7.55 TTL.1 ; 9.75,32.86 v1(9.75,31.61) ; FPC1.26 6.39,39.59 v1(8.04,39.59) 8.48,39.59 8.78,39.29 FPC1.2
  Bottom Layer w0.254: C16.2 12.12,18.94 v1(12.12,20.09)
  vias: v1(7.49,58.7) v1(7.49,57.33) v1(7.47,55.93) v1(8.67,58.7) v1(8.67,57.33) v1(8.65,55.93) v1(9.84,55.93) v1(9.86,58.7) v1(9.86,57.33) v1(11.02,55.93) v1(11.04,58.7) v1(11.04,57.33) v1(12.23,58.7) v1(12.22,57.33) v1(12.2,55.93) v1(12.56,31.56) v1(13.41,58.7) v1(13.41,57.33) v1(13.39,55.93) v1(26.97,25.1) v1(34.76,49.57) v1(38.36,49.55) v1(38.36,46.82) v1(38.36,45.24) v1(51.42,58.45) v1(51.42,57.08) v1(51.4,55.68) v1(52.6,58.45) v1(52.6,57.08) v1(52.58,55.68) v1(52.64,3.52) v1(52.66,6.29) v1(52.66,4.92) v1(53.79,58.45) v1(53.79,57.08) v1(53.77,55.68) v1(53.82,3.52) v1(53.84,6.29) v1(53.84,4.92) v1(54.97,58.45) v1(54.97,57.08) v1(54.95,55.68) v1(55.03,6.29) v1(55.03,4.92) v1(55.01,3.52) v1(56.13,55.68) v1(56.16,58.45) v1(56.15,57.08) v1(56.21,6.29) v1(56.21,4.92) v1(56.19,3.52) v1(57.34,58.45) v1(57.34,57.08) v1(57.32,55.68) v1(57.4,6.29) v1(57.39,4.92) v1(57.37,3.52) v1(58.58,6.29) v1(58.58,4.92) v1(58.56,3.52)
DTR: length 7
  Top Layer w0.124: U5.13 33.35,23.33 36.29,26.27 R1.2 36.29,28.14 Q2.2
EN: length 136.8
  Top Layer w0.254: 24.87,30.1 24.83,30.15 11.44,30.15 10.78,30.81 FPC1.6 ; 24.87,30.1 24.92,30.14 Q1.3 ; 24.87,30.1 24.11,29.33 24.11,27.25 24.06,27.21 R4.2 24.06,8.89 21.38,6.21 RST.1 14.06,8.09 12.97,9.19 5.22,9.19 3.71,10.7 3.71,51.16 5.33,52.78 24.85,52.78 25.28,52.35 C5.1 28.09,51.66 28.14,51.71
IO0: length 47.7
  Top Layer w0.254: 48.17,37.63 45.74,37.63 45.64,37.74 45.64,30.12 v1(45.62,30.14) Q2.3 ; v1(44.56,9.4) 44.56,6.25 BOOT.1
  Bottom Layer w0.254: v1(44.56,9.4) 46.44,9.4 47.74,10.7 47.74,28.02 v1(45.62,30.14)
IO1_LCD_CS: length 22.9
  Top Layer w0.254: 45.64,52.98 v1(47.95,52.98)
  Bottom Layer w0.254: U7.3 55.1,42.49 53.94,43.65 53.94,51.58 52.55,52.98 v1(47.95,52.98)
IO2_LCD_RST: length 24.6
  Top Layer w0.254: 47.95,51.71 47.95,51.71 45.64,51.71
  Bottom Layer w0.254: U7.4 53.98,39.95 53.48,40.45 53.48,50.36 52.14,51.71 v1(47.95,51.71)
IO3: length 19.1
  Top Layer w0.254: R10.2 v1(19.91,27.96) ; v1(29.91,34.91) 29.9,34.92 29.9,36.46
  Bottom Layer w0.254: v1(29.91,34.91) 20.87,34.91 19.91,33.95 v1(19.91,27.96)
IO4_I2C_SDA: length 30.1
  Top Layer w0.254: FPC1.3 9.28,46.96 12.75,50.44 28.14,50.44
IO5_I2C_SCL: length 28.2
  Top Layer w0.254: FPC1.5 10.28,46.37 13.08,49.17 28.14,49.17
IO6_VYSNC: length 26.2
  Top Layer w0.254: 28.14,47.9 13.61,47.9 11.28,45.56 FPC1.7
IO7_HREF: length 24.4
  Top Layer w0.254: FPC1.9 12.28,45.05 13.86,46.63 28.14,46.63
IO8_Y4: length 15.7
  Top Layer w0.254: FPC1.22 18.78,35.83 19.86,34.75 25.37,34.75 26.24,35.62 26.24,39.53 26.98,40.28 28.14,40.28
IO9_Y3: length 18.7
  Top Layer w0.254: 32.45,36.46 32.49,36.41 32.49,34.59 31.88,33.98 19.62,33.98 18.28,35.32 FPC1.21
IO10_Y5: length 21.6
  Top Layer w0.254: 33.71,36.46 33.71,33.98 33.06,33.32 19.38,33.32 17.78,34.92 FPC1.20
IO11_Y2: length 24.2
  Top Layer w0.254: 34.98,36.46 35.03,36.41 35.03,33.92 33.79,32.68 19.11,32.68 17.28,34.51 FPC1.19
IO12_Y6: length 26.9
  Top Layer w0.254: 36.25,36.46 36.35,36.36 36.35,33.91 34.53,32.09 18.68,32.09 16.78,33.99 FPC1.18
IO13_PCLK: length 29.1
  Top Layer w0.254: FPC1.17 16.28,33.72 18.52,31.48 34.8,31.48 37.63,34.31 37.63,36.35 37.52,36.46
IO15_XCLK: length 23.4
  Top Layer w0.254: v1(15.02,35.92) 14.85,35.92 14.28,36.49 FPC1.13 ; 28.14,45.36 v1(26.07,45.36)
  Bottom Layer w0.254: v1(15.02,35.92) 24.74,35.92 26.07,37.25 v1(26.07,45.36)
IO16_Y9: length 20.4
  Top Layer w0.254: 28.14,44.09 28.14,44.09 15.26,44.09 13.78,42.61 FPC1.12
IO17_Y8: length 18
  Top Layer w0.254: FPC1.14 14.78,41.13 16.47,42.82 28.14,42.82 28.14,42.82
IO18_Y7: length 15.7
  Top Layer w0.254: 28.14,41.55 28.14,41.54 17.64,41.54 15.78,39.68 FPC1.16
IO21_LCD_CS: length 31.7
  Top Layer w0.254: 40.06,36.46 40.06,34.59 v1(40.08,34.57)
  Bottom Layer w0.254: v1(40.08,34.57) 40.08,32.58 41.46,31.2 47.88,31.2 48.76,30.32 48.76,23.42 50.02,22.16 59.56,22.16 U7.11
IO38_SD_CMD: length 71.9
  Top Layer w0.254: 45.64,42.82 v1(47.89,42.82)
  Bottom Layer w0.254: v1(47.89,42.82) 49.36,42.82 50.12,42.06 50.12,39.84 49.35,39.07 34.24,39.07 31.91,36.74 31.91,23.61 29.2,20.9 8.96,20.9 8.28,20.22 8.28,18.68 9.08,17.89 10.05,17.89 10.11,17.95 10.11,17.15 10.96,16.3 10.96,14.86 CARD1.3
IO39_SD_CLK: length 67.5
  Top Layer w0.254: 45.64,44.09 v1(47.87,44.09)
  Bottom Layer w0.254: v1(47.87,44.09) 49.95,44.09 50.75,43.29 50.75,39.33 49.69,38.27 34.6,38.27 32.59,36.26 32.59,22.35 30.32,20.08 15.61,20.08 15.18,19.65 15.18,18.29 14.81,17.92 13.95,17.92 13.92,17.95 13.92,17.4 13.11,16.59 13.11,14.85 CARD1.5
IO40_SD_DATA: length 67.8
  Top Layer w0.254: 45.64,45.36 47.89,45.36 v1(47.9,45.35)
  Bottom Layer w0.254: v1(47.9,45.35) 50.3,45.35 51.41,44.24 51.41,38.51 50.22,37.32 34.96,37.32 33.27,35.63 33.27,20.76 30.46,17.95 16.35,17.95 16.35,17 15.29,15.94 15.29,14.87 CARD1.7
IO41_LCD_MOSI: length 47.8
  Top Layer w0.254: U7.12 59.54,19.6 58.29,19.6 57.03,20.86 R21.1 ; 45.64,46.63 v1(47.92,46.63)
  Bottom Layer w0.254: U7.12 61.37,19.63 61.86,20.12 61.86,34.33 61.31,34.88 59.58,34.88 U7.6 59.54,34.84 53.38,34.84 52.3,35.92 52.3,45.32 50.99,46.63 v1(47.92,46.63)
IO42_LCD_DC: length 22.9
  Top Layer w0.254: 45.64,47.9 v1(47.92,47.9)
  Bottom Layer w0.254: U7.5 59.52,37.36 54.04,37.36 52.9,38.5 52.9,46.34 51.34,47.9 v1(47.92,47.9)
IO45_LCD_SCK: length 37.5
  Top Layer w0.254: v1(43.89,34.61) 43.89,36.47 43.87,36.49 ; 57.48,24.69 56.76,25.41 56.76,31.58 57.51,32.33 U7.7 ; 57.48,24.69 55.22,24.69 54.03,23.5 54.03,20.84 ; 57.48,24.69 59.55,24.69 U7.10
  Bottom Layer w0.254: U7.7 50.6,32.33 48.33,34.61 v1(43.89,34.61)
IO47_LCD_MISO: length 38.6
  Top Layer w0.254: 41.33,36.46 v1(41.33,34.62) ; U7.13 61.33,17.09 61.78,17.54 61.78,26.63 61.12,27.29 59.61,27.29 U7.9
  Bottom Layer w0.254: v1(41.33,34.62) 41.33,33.63 42.48,32.48 48.46,32.48 50.19,30.75 50.19,29.12 52.06,27.25 U7.9
IO48: length 3.7
  Top Layer w0.254: 42.55,32.84 42.62,32.92 42.62,36.44 42.61,36.46
RTS: length 6.9
  Top Layer w0.124: U5.14 32.08,23.42 29.39,26.11 ; 29.41,26.11 R2.2 29.41,28.14 Q1.2
RXD0: length 38
  Top Layer w0.124: R7.2 38.69,25.96 38.78,26.05 38.78,27.67 39.48,28.37 48.76,28.37 49.55,29.16 49.55,49.23 49.14,49.64 46.99,49.64 46.51,49.17 45.64,49.17
TXD0: length 60.9
  Top Layer w0.124: TX.1 46.97,12.48 47.3,12.81 47.3,25.35 46.71,25.94 39.78,25.94 R6.2 39.2,25.96 39.11,26.05 39.11,27.54 39.61,28.04 48.89,28.04 49.88,29.02 49.88,49.37 49.28,49.96 46.99,49.96 46.51,50.44 45.64,50.44
USB_5V: length 55.7
  Top Layer w0.5: v1(31.25,8.67) 31.25,7.57 31.28,7.55 ; 26.48,7.55 26.48,7.57 26.38,7.66 26.38,9.04 v1(26.41,9.07)
  PWR w0.254: v1(39.94,31.32) 39.99,31.27 39.99,24.67 39.26,23.94 v1(29.53,23.94) 29.53,20.71 29.03,20.21 27.04,20.21 26.41,19.58 v1(26.41,9.07) 26.41,6.83 27.42,5.82 29.99,5.82 31.25,7.08 v1(31.25,8.67) 31.25,10.28 31.88,10.91 35.13,10.91 35.58,10.46 v1(35.58,8.19)
USB_DN: length 20.7
  Top Layer w0.124: U5.6 35.89,16.59 35.1,15.8 35.1,14.05 34.06,13.01 33.56,13.01 33.47,13.09 33.47,13.4 33.38,13.49 33.06,13.49 32.97,13.4 32.97,13.09 32.88,13.01 32.56,13.01 32.47,13.09 32.47,13.4 32.38,13.49 32.06,13.49 31.97,13.4 31.97,13.09 31.88,13.01 31.56,13.01 31.47,13.09 31.47,13.4 31.38,13.49 31.06,13.49 30.97,13.4 30.97,13.09 30.88,13.01 29.4,13.01 28.76,12.37 28.76,9.65 28.12,9.01 28.12,8.41 28.03,8.32 TTL.B7 28.03,6.5 28.34,6.19 28.82,6.19 29.05,6.42 29.05,7.53 TTL.A7
USB_DP: length 20.7
  Top Layer w0.124: TTL.B6 29.55,7.57 29.55,8.59 29.37,8.77 28.75,8.77 28.53,8.55 28.53,8.32 ; U5.5 34.62,16.63 35.69,17.69 36.09,17.69 36.38,17.4 36.38,15.81 35.43,14.85 35.43,13.91 34.19,12.68 29.53,12.68 29.09,12.23 29.09,9.51 28.44,8.87 28.44,8.41 28.53,8.32 ; 28.53,8.32 TTL.A6
$1N3928: length 2
  Top Layer w0.254: TX.2 45.52,14.13 R8.1
$1N3930: length 2
  Top Layer w0.254: PWR.2 49.27,15.96 49.17,16.06
$1N3939: length 17.6
  Top Layer w0.124: U5.2 31.28,17.08 31.28,18.15 31.89,18.76 39.43,18.76 39.72,19.05 39.72,23.81 38.78,24.75 38.78,25.01 38.69,25.1 R7.1
$1N3940: length 17.6
  Top Layer w0.124: U5.3 31.61,17.08 31.61,18.02 32.02,18.43 39.56,18.43 40.05,18.91 40.05,23.95 39.11,24.89 39.11,25.01 39.2,25.1 R6.1
$1N3941: length 2
  Top Layer w0.254: U5.4 33.37,16.59 33.37,14.65 C11.1
$1N3953: length 10.9
  Top Layer w0.254: R1.1 35.43,28.69 34.97,29.15 27.79,29.15 27.53,28.89 Q1.1
$1N3956: length 4.8
  Top Layer w0.254: R2.1 31.86,26.62 33.4,28.16 Q2.1
$1N3967: length 1.6
  Top Layer w0.254: R10.1 R9.2
$1N3982: length 2.5
  Top Layer w0.254: 30.5,10.01 30.53,9.98 TTL.B5
$1N3984: length 2.5
  Top Layer w0.254: TTL.A5 27.55,7.57 27.55,10.01
$1N4024: length 3.5
  Top Layer w0.254: 11.74,33.65 11.78,33.69 FPC1.8

## Copper pours and planes (outline as drawn; the poured copper is in the pictures)
1.2V on Bottom Layer: 7.9,23.91 7.9,28.1 8.07,28.26 8.07,30.85 9.62,30.85 9.62,23.99 9.54,23.91
2.8V on Bottom Layer: 14.18,23.93 14.18,28.12 14.34,28.28 14.34,29.66 16.5,29.66 16.5,24.62 15.81,23.93
3V3 on Top Layer: 52.86,20.28 52.86,17.73 52.85,17.72 56.91,17.72 56.91,20.25 56.89,20.27 52.87,20.27
3V3 on Top Layer: 21.02,28.64 21.02,26.44 21.04,26.42 23.45,26.42 23.52,26.49 23.52,28.62 23.5,28.64
3V3 on Bottom Layer: 15.85,19.65 15.85,18.43 18.5,18.43 18.5,19.61 18.46,19.65
3V3 on Bottom Layer: 40.53,6.75 40.53,11.42 40.51,11.44 41.29,12.22 42.08,12.22 42.08,15.79 42.06,15.81 42.06,22.14 39.82,22.14 39.82,15.34 39.91,15.25 38.2,15.25 37.89,14.94 37.89,11.82 38.87,11.82 39.33,11.36 39.33,6.78 39.36,6.75
3V3 on Bottom Layer: 7.25,22.92 7.25,21.41 14.89,21.41 14.98,21.41 14.98,22.93 15.02,22.97 7.3,22.97
3V3 on PWR: 42.65,20.78 43.4,20.03 43.93,20.03 44.55,20.65 44.55,20.78
3V3 on PWR: 16.75,22.14 17.64,21.24 17.65,21.24 18.51,22.11 18.51,22.14
3V3 on PWR: 23.01,36.56 23.01,34.29 23.09,34.21 24.86,34.21 24.94,34.29 24.94,36.52 24.9,36.56
3V3 on PWR: 50.83,21.12 51.06,20.37 51.59,20.37 52.21,20.99 52.21,21.12
GND on Top Layer: 24.88,25.81 24.88,23.28 24.87,23.27 28.35,23.27 28.37,23.29 28.37,25.82 28.36,25.81
GND on Top Layer: -4.8,65.14 69.38,65.14 69.38,-1.93 -4.8,-1.93
GND on Top Layer: 32.94,50.46 39.31,50.46 39.31,44.09 32.94,44.09
GND on Top Layer: 11.24,32.99 11.24,31.09 11.22,31.07 15.86,31.07 15.87,31.08 15.87,33 15.9,33.03 11.28,33.03
GND on Bottom Layer: 14.09,29.68 14.09,28.58 13.75,28.23 13.75,23.94 13.73,23.92 12.45,23.92 12.27,24.1 12.27,29.66 12.29,29.68 14.09,29.68
GND on Bottom Layer: 7.83,29.74 7.83,28.64 7.48,28.29 7.48,24 7.46,23.98 6.18,23.98 6,24.16 6,29.72 6.02,29.74
GND on Bottom Layer: -4.97,64.15 69.21,64.15 69.21,-2.92 -4.97,-2.92
GND on GND: -5.28,64.51 68.9,64.51 68.9,-2.56 -5.28,-2.56
GND on PWR: -1.23,63.45 67.27,63.45 67.27,0.67 -1.23,0.67
EN on Top Layer: 23.08,30.73 25.41,30.73 25.41,28.81 23.08,28.81
IO45_LCD_SCK on Top Layer: 56.1,25.68 56.1,24.26 56.09,24.25 57.69,24.25 57.71,24.23 57.71,25.65 57.72,25.66 56.12,25.66
USB_5V on Top Layer: 24.74,22.8 24.74,21.23 24.73,21.22 29.91,21.22 30.01,21.32 30.01,24.54 29.23,24.54 28.67,22.81 24.93,22.81 24.92,22.8
USB_5V on Top Layer: 43.16,31.96 43.16,30.68 39.23,30.68 39.23,31.94 43.14,31.94
USB_5V on Bottom Layer: 37.74,0.73 37.74,6.35 38.18,6.79 38.32,6.79 38.32,9.74 38.28,9.78 34.82,9.78 34.72,0.73

## Text on the board
Bottom Silkscreen Layer: 1
Top Silkscreen Layer: Author: | MYRY
